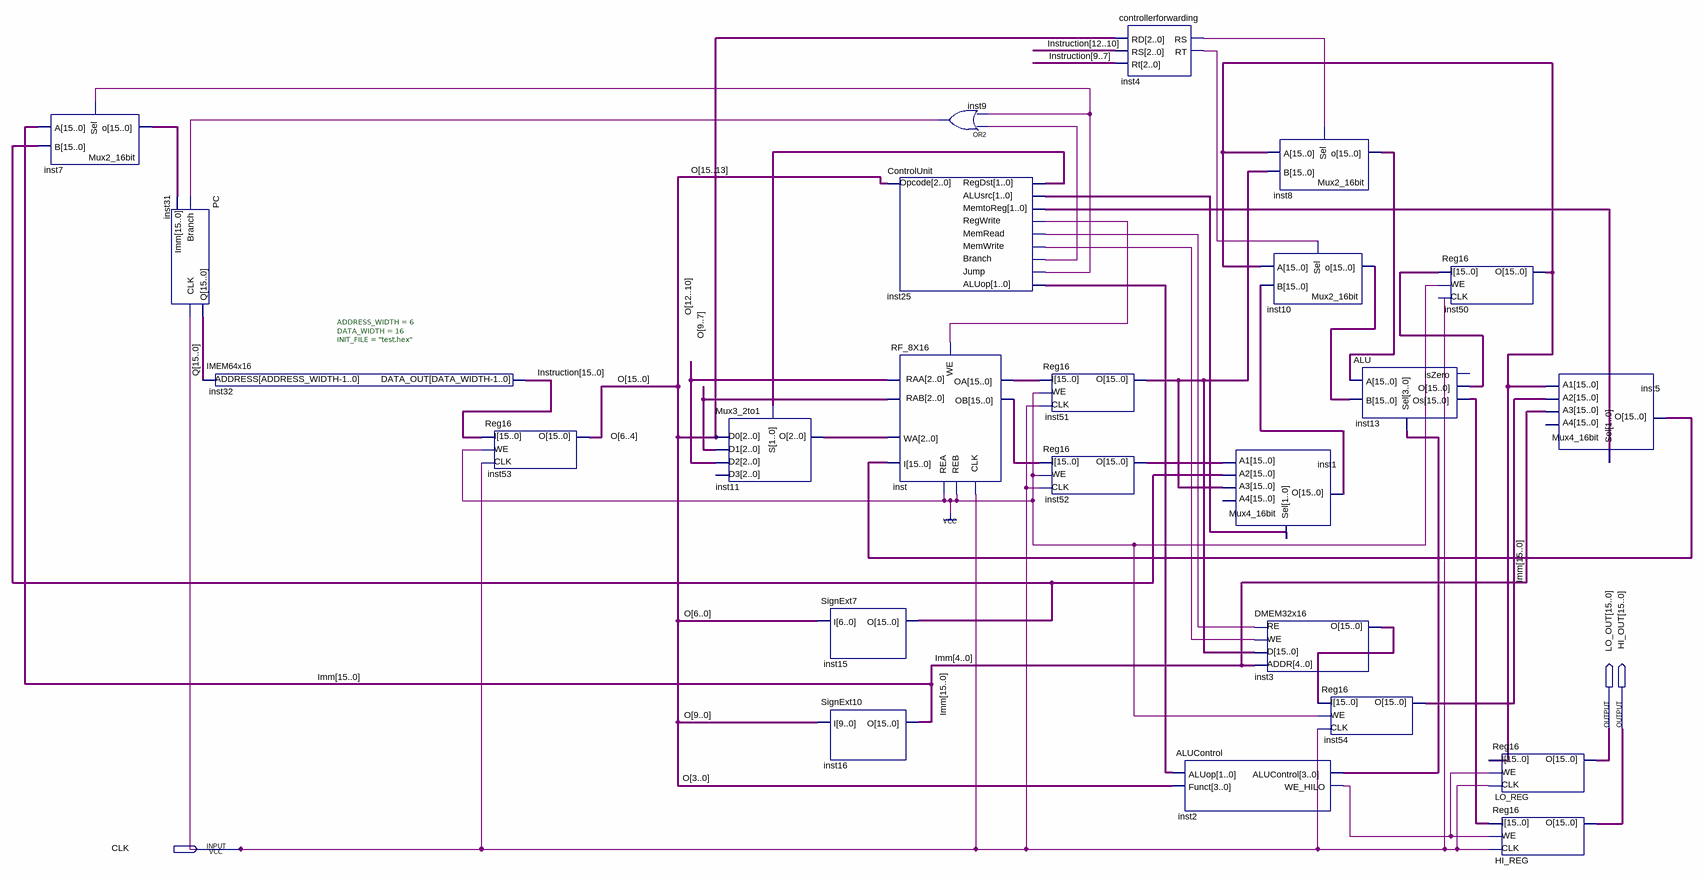
[diagram p0: schematic sheet]
// Quartus schematic CPUTopDesign (1).bdf as structural Verilog: 24 symbols, 3 pins
module \CPUTopDesign_(1)  (
  input  CLK,
  output [15:0] LO_OUT,
  output [15:0] HI_OUT
);

  wire inst2_we_hilo, inst4_rs, inst4_rt, inst9_out, inst25_branch, inst25_jump, inst25_memread,
       inst25_memwrite, inst25_regwrite;
  wire [1:0] inst25_aluop, inst25_alusrc, inst25_memtoreg, inst25_regdst;
  wire [2:0] inst11_o;
  wire [3:0] inst2_alucontrol;
  wire [15:0] Imm, inst1_o, inst3_o, inst5_o, inst7_o, inst8_o, inst10_o, inst13_o, inst13_os, inst15_o,
       inst50_o, inst51_o, inst52_o, inst54_o, inst_oa, inst_ob, Instruction, O, Q;

  Mux2_16bit inst7 (.Sel(inst25_jump), .A(Imm), .B(inst15_o), .o(inst7_o));
  PC inst31 (.Branch(inst9_out), .Imm(inst7_o), .CLK(CLK), .Q(Q));
  IMEM64x16 #(.ADDRESS_WIDTH(6), .DATA_WIDTH(16), .INIT_FILE("test.hex")) inst32 (.ADDRESS(Q), .DATA_OUT(Instruction));
  Reg16 inst53 (.WE(1'b1), .CLK(CLK), .I(Instruction), .O(O));
  Mux3_2to1 inst11 (.D0(O[6:4]), .D1(O[9:7]), .D2(O[12:10]), .S(inst25_regdst), .O(inst11_o));  // open: D3
  SignExt7 inst15 (.I(O[6:0]), .O(inst15_o));
  SignExt10 inst16 (.I(O[9:0]), .O(Imm));
  ControlUnit inst25 (
    .Opcode(O[15:13]), .RegDst(inst25_regdst), .ALUsrc(inst25_alusrc), .MemtoReg(inst25_memtoreg),
    .RegWrite(inst25_regwrite), .MemRead(inst25_memread), .MemWrite(inst25_memwrite), .Branch(inst25_branch),
    .Jump(inst25_jump), .ALUop(inst25_aluop));
  RF_8X16 inst (
    .I(inst5_o), .WA(inst11_o), .WE(inst25_regwrite), .RAA(O[12:10]), .REA(1'b1), .RAB(O[9:7]), .REB(1'b1),
    .CLK(CLK), .OB(inst_ob), .OA(inst_oa));
  or inst9 (inst9_out, inst25_branch, inst25_jump);
  Reg16 inst51 (.WE(1'b1), .CLK(CLK), .I(inst_oa), .O(inst51_o));
  Reg16 inst52 (.WE(1'b1), .CLK(CLK), .I(inst_ob), .O(inst52_o));
  controllerforwarding inst4 (.RD(O[6:4]), .RS({Instruction[12:10], inst4_rs}), .Rt(Instruction[9:7]), .RT(inst4_rt));
  ALUControl inst2 (.ALUop(inst25_aluop), .Funct(O[3:0]), .ALUControl(inst2_alucontrol), .WE_HILO(inst2_we_hilo));
  Mux4_16bit inst1 (.Sel(inst25_alusrc), .A3(inst51_o), .A2(inst15_o), .A1(inst52_o), .O(inst1_o));  // open: A4
  Mux2_16bit inst8 (.Sel(inst4_rs), .A(inst50_o), .B(inst51_o), .o(inst8_o));
  Mux2_16bit inst10 (.Sel(inst4_rt), .A(inst50_o), .B(inst1_o), .o(inst10_o));
  DMEM32x16 inst3 (.RE(inst25_memread), .WE(inst25_memwrite), .D(inst51_o), .ADDR(Imm), .O(inst3_o));
  Reg16 inst54 (.WE(1'b1), .CLK(CLK), .I(inst3_o), .O(inst54_o));
  ALU inst13 (.Sel(inst2_alucontrol), .A(inst8_o), .B(inst10_o), .O(inst13_o), .Os(inst13_os));  // open: isZero
  Reg16 inst50 (.WE(1'b1), .CLK(CLK), .I(inst13_o), .O(inst50_o));
  Reg16 LO_REG (.WE(inst2_we_hilo), .CLK(CLK), .I(inst50_o), .O(LO_OUT));
  Reg16 HI_REG (.WE(inst2_we_hilo), .CLK(CLK), .I(inst13_os), .O(HI_OUT));
  Mux4_16bit inst5 (.Sel(inst25_memtoreg), .A3(Imm), .A2(inst54_o), .A1(inst50_o), .O(inst5_o));  // open: A4
endmodule
